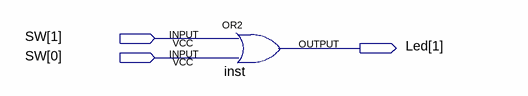
[diagram p0: schematic sheet]
// Quartus schematic Ex1.bdf as structural Verilog: 1 symbols, 3 pins
module Ex1 (
  input  [1:0] SW,
  output [1:1] Led
);

  or inst (Led[1], SW[1], SW[0]);
endmodule
